# EAGLE schematic Motor Breakout (EAGLE 6.3)
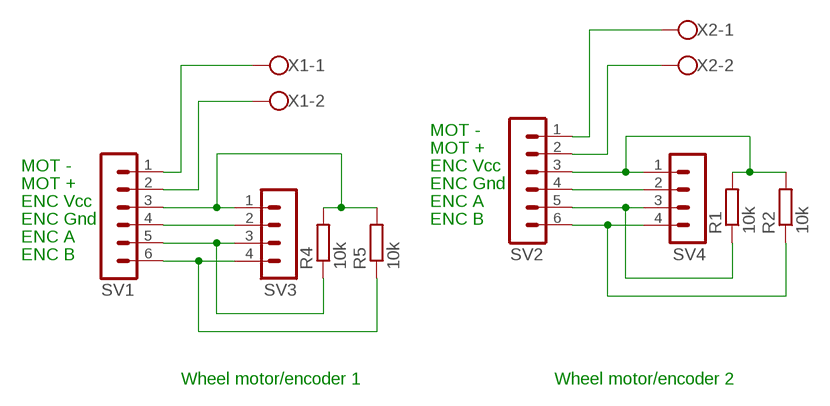
[diagram p0: schematic, sheet 1]

## Parts
R1  10k  R-EU_0204/7  [0204/7]
R2  10k  R-EU_0204/7  [0204/7]
R4  10k  R-EU_0204/7  [0204/7]
R5  10k  R-EU_0204/7  [0204/7]
SV1  MA06-1  [MA06-1]
SV2  MA06-1  [MA06-1]
SV3  MA04-1  [MA04-1]
SV4  MA04-1  [MA04-1]
X1  W237-102  [W237-102]
X2  W237-102  [W237-102]

## Nets
N$1: SV1.1 X1.1
N$2: SV1.2 X1.2
N$4: SV1.4 SV3.2
N$5: R4.1 SV1.5 SV3.3
N$6: R4.2 R5.2 SV1.3 SV3.1
N$7: R5.1 SV1.6 SV3.4
N$9: SV2.1 X2.1
N$10: SV2.2 X2.2
N$11: SV2.4 SV4.2
N$12: R1.1 SV2.5 SV4.3
N$13: R2.1 SV2.6 SV4.4
N$14: R1.2 R2.2 SV2.3 SV4.1

## Notes on the sheet
- MOT -
- MOT +
- MOT - | ENC Vcc
- MOT + | ENC Gnd
- ENC Vcc | ENC A
- ENC Gnd | ENC B
- ENC A
- ENC B
- Wheel motor/encoder 1 | Wheel motor/encoder 2

## Library data of the parts
R1 R2 R4 R5 = resistor:R-EU_: RESISTOR, European symbol
SV1 SV2 = con-lstb:MA06-1: PIN HEADER; OC_FARNELL: unknown; OC_NEWARK: unknown
SV3 SV4 = con-lstb:MA04-1: PIN HEADER; OC_FARNELL: unknown; OC_NEWARK: unknown
X1 X2 = con-wago-500:W237-102: WAGO SCREW CLAMP; MPN: 237-102; OC_FARNELL: unknown; OC_NEWARK: 70K9898